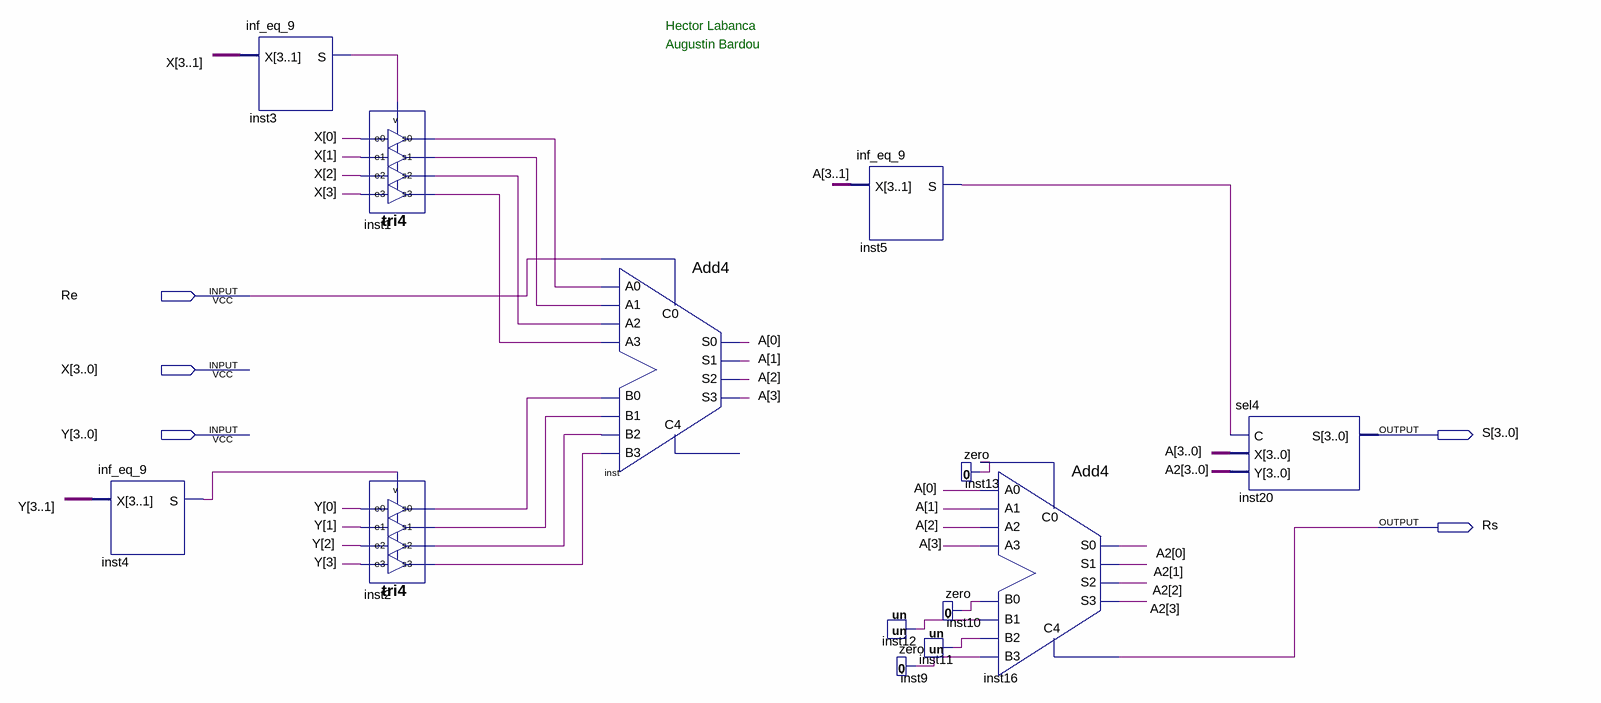
[diagram p0: schematic sheet]
// Quartus schematic Addec1.bdf as structural Verilog: 13 symbols, 5 pins
module Addec1 (
  input  Re,
  input  [3:0] X,
  input  [3:0] Y,
  output [3:0] S,
  output Rs
);

  wire inst1_s0, inst1_s1, inst1_s2, inst1_s3, inst2_s0, inst2_s1, inst2_s2, inst2_s3, inst3_s, inst4_s,
       inst5_s, inst9_0, inst10_0, inst11_un, inst12_un, inst13_0;
  wire [3:0] A, A2;

  inf_eq_9 inst4 (.X(Y[3:1]), .S(inst4_s));
  inf_eq_9 inst3 (.X(X[3:1]), .S(inst3_s));
  tri4 inst1 (
    .e1(X[1]), .e0(X[0]), .e2(X[2]), .e3(X[3]), .v(inst3_s), .s1(inst1_s1), .s0(inst1_s0), .s2(inst1_s2),
    .s3(inst1_s3));
  tri4 inst2 (
    .e1(Y[1]), .e0(Y[0]), .e2(Y[2]), .e3(Y[3]), .v(inst4_s), .s1(inst2_s1), .s0(inst2_s0), .s2(inst2_s2),
    .s3(inst2_s3));
  Add4 inst (
    .C0(Re), .A3(inst1_s3), .A2(inst1_s2), .A1(inst1_s1), .A0(inst1_s0), .B3(inst2_s3), .B2(inst2_s2),
    .B1(inst2_s1), .B0(inst2_s0), .S3(A[3]), .S2(A[2]), .S1(A[1]), .S0(A[0]));  // open: C4
  inf_eq_9 inst5 (.X(A[3:1]), .S(inst5_s));
  zero inst10 (.\0 (inst10_0));
  un inst12 (.un(inst12_un));
  un inst11 (.un(inst11_un));
  zero inst9 (.\0 (inst9_0));
  zero inst13 (.\0 (inst13_0));
  Add4 inst16 (
    .C0(inst13_0), .A3(A[3]), .A2(A[2]), .A1(A[1]), .A0(A[0]), .B3(inst9_0), .B2(inst11_un), .B1(inst12_un),
    .B0(inst10_0), .C4(Rs), .S3(A2[3]), .S2(A2[2]), .S1(A2[1]), .S0(A2[0]));
  sel4 inst20 (.C(inst5_s), .X(A), .Y(A2), .S(S));

  // Notes on the sheet:
  //   Hector Labanca
  //   Augustin Bardou
endmodule
